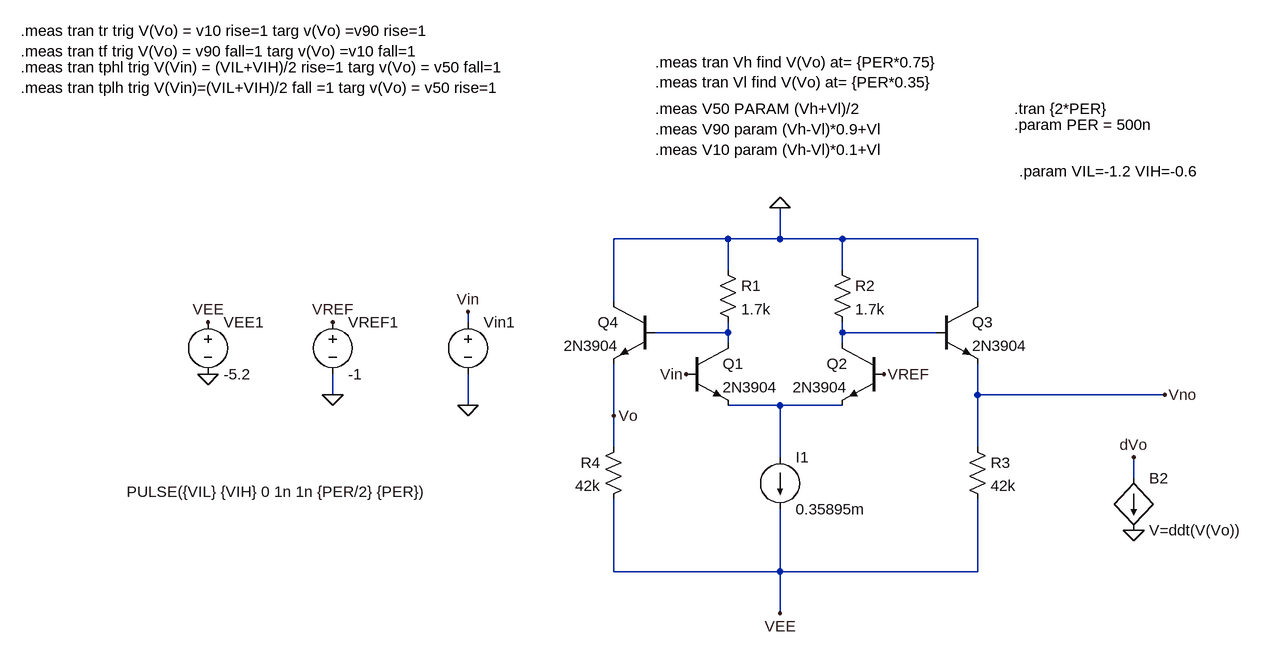
[diagram p0: schematic ECL_inverter_propagation.asc]
ECL_inverter_propagation.asc, the LTspice schematic file:
Version 4
SHEET 1 1272 680
WIRE -384 -192 -560 -192
WIRE -304 -192 -304 -240
WIRE -304 -192 -384 -192
WIRE -208 -192 -304 -192
WIRE 0 -192 -208 -192
WIRE -384 -144 -384 -192
WIRE -208 -144 -208 -192
WIRE -560 -96 -560 -192
WIRE 0 -96 0 -192
WIRE -784 -64 -784 -80
WIRE -384 -48 -384 -64
WIRE -384 -48 -496 -48
WIRE -208 -48 -208 -64
WIRE -64 -48 -208 -48
WIRE -384 -32 -384 -48
WIRE -208 -32 -208 -48
WIRE -992 48 -992 16
WIRE 0 48 0 0
WIRE 288 48 0 48
WIRE -784 64 -784 16
WIRE -304 64 -384 64
WIRE -208 64 -304 64
WIRE -560 80 -560 0
WIRE -560 128 -560 80
WIRE 0 128 0 48
WIRE -304 144 -304 64
WIRE 240 176 240 144
WIRE -560 320 -560 208
WIRE -304 320 -304 224
WIRE -304 320 -560 320
WIRE 0 320 0 208
WIRE 0 320 -304 320
WIRE -304 384 -304 320
FLAG -784 64 0
FLAG -992 48 0
FLAG -992 -64 VREF
FLAG 288 48 Vno
FLAG 240 256 0
FLAG 240 144 dVo
FLAG -784 -80 Vin
FLAG -448 16 Vin
FLAG -1184 -64 VEE
FLAG -1184 16 0
FLAG -144 16 VREF
FLAG -304 -240 0
FLAG -304 384 VEE
FLAG -560 80 Vo
SYMBOL voltage -784 -80 R0
WINDOW 123 0 0 Left 0
WINDOW 39 0 0 Left 0
WINDOW 3 -525 277 Left 2
SYMATTR Value PULSE({VIL} {VIH} 0 1n 1n {PER/2} {PER})
SYMATTR InstName Vin1
SYMBOL voltage -992 -80 R0
SYMATTR InstName VREF1
SYMATTR Value -1
SYMBOL bi 240 176 R0
SYMATTR InstName B2
SYMATTR Value V=ddt(V(Vo))
SYMBOL npn -448 -32 R0
SYMATTR InstName Q1
SYMATTR Value 2N3904
SYMBOL npn -144 -32 M0
SYMATTR InstName Q2
SYMATTR Value 2N3904
SYMBOL npn -64 -96 R0
SYMATTR InstName Q3
SYMATTR Value 2N3904
SYMBOL res -400 -160 R0
SYMATTR InstName R1
SYMATTR Value 1.7k
SYMBOL res -224 -160 R0
SYMATTR InstName R2
SYMATTR Value 1.7k
SYMBOL res -16 112 R0
SYMATTR InstName R3
SYMATTR Value 42k
SYMBOL current -304 144 R0
WINDOW 123 0 0 Left 0
WINDOW 39 0 0 Left 0
SYMATTR InstName I1
SYMATTR Value 0.35895m
SYMBOL voltage -1184 -80 R0
SYMATTR InstName VEE1
SYMATTR Value -5.2
SYMBOL npn -496 -96 M0
SYMATTR InstName Q4
SYMATTR Value 2N3904
SYMBOL res -544 112 M0
SYMATTR InstName R4
SYMATTR Value 42k
TEXT -496 -464 Left 2 !.meas tran Vh find V(Vo) at= {PER*0.75}\n.meas tran Vl find V(Vo) at= {PER*0.35}
TEXT -496 -392 Left 2 !.meas V50 PARAM (Vh+Vl)/2\n.meas V90 param (Vh-Vl)*0.9+Vl\n.meas V10 param (Vh-Vl)*0.1+Vl
TEXT -1472 -512 Left 2 !.meas tran tr trig V(Vo) = v10 rise=1 targ v(Vo) =v90 rise=1\n.meas tran tf trig V(Vo) = v90 fall=1 targ v(Vo) =v10 fall=1
TEXT -1472 -456 Left 2 !.meas tran tphl trig V(Vin) = (VIL+VIH)/2 rise=1 targ v(Vo) = v50 fall=1\n.meas tran tplh trig V(Vin)=(VIL+VIH)/2 fall =1 targ v(Vo) = v50 rise=1
TEXT 56 -392 Left 2 !.tran {2*PER}
TEXT 56 -368 Left 2 !.param PER = 500n
TEXT 64 -296 Left 2 !.param VIL=-1.2 VIH=-0.6

The netlist it stands for:
* ECL_inverter_propagation.asc
Vin1 Vin 0 PULSE({VIL} {VIH} 0 1n 1n {PER/2} {PER})
VREF1 VREF 0 -1
B2 dVo 0 V=ddt(V(Vo))
Q1 N001 Vin N003 0 2N3904
Q2 N002 VREF N003 0 2N3904
Q3 0 N002 Vno 0 2N3904
R1 0 N001 1.7k
R2 0 N002 1.7k
R3 Vno VEE 42k
I1 N003 VEE 0.35895m
VEE1 VEE 0 -5.2
Q4 0 N001 Vo 0 2N3904
R4 Vo VEE 42k
.model NPN NPN
.model PNP PNP
.lib standard.bjt
.meas tran Vh find V(Vo) at= {PER*0.75}
.meas tran Vl find V(Vo) at= {PER*0.35}
.meas V50 PARAM (Vh+Vl)/2
.meas V90 param (Vh-Vl)*0.9+Vl
.meas V10 param (Vh-Vl)*0.1+Vl
.meas tran tr trig V(Vo) = v10 rise=1 targ v(Vo) =v90 rise=1
.meas tran tf trig V(Vo) = v90 fall=1 targ v(Vo) =v10 fall=1
.meas tran tphl trig V(Vin) = (VIL+VIH)/2 rise=1 targ v(Vo) = v50 fall=1
.meas tran tplh trig V(Vin)=(VIL+VIH)/2 fall =1 targ v(Vo) = v50 rise=1
.tran {2*PER}
.param PER = 500n
.param VIL=-1.2 VIH=-0.6
.backanno
.end